# EAGLE design sequencer (EAGLE 9.6.2)
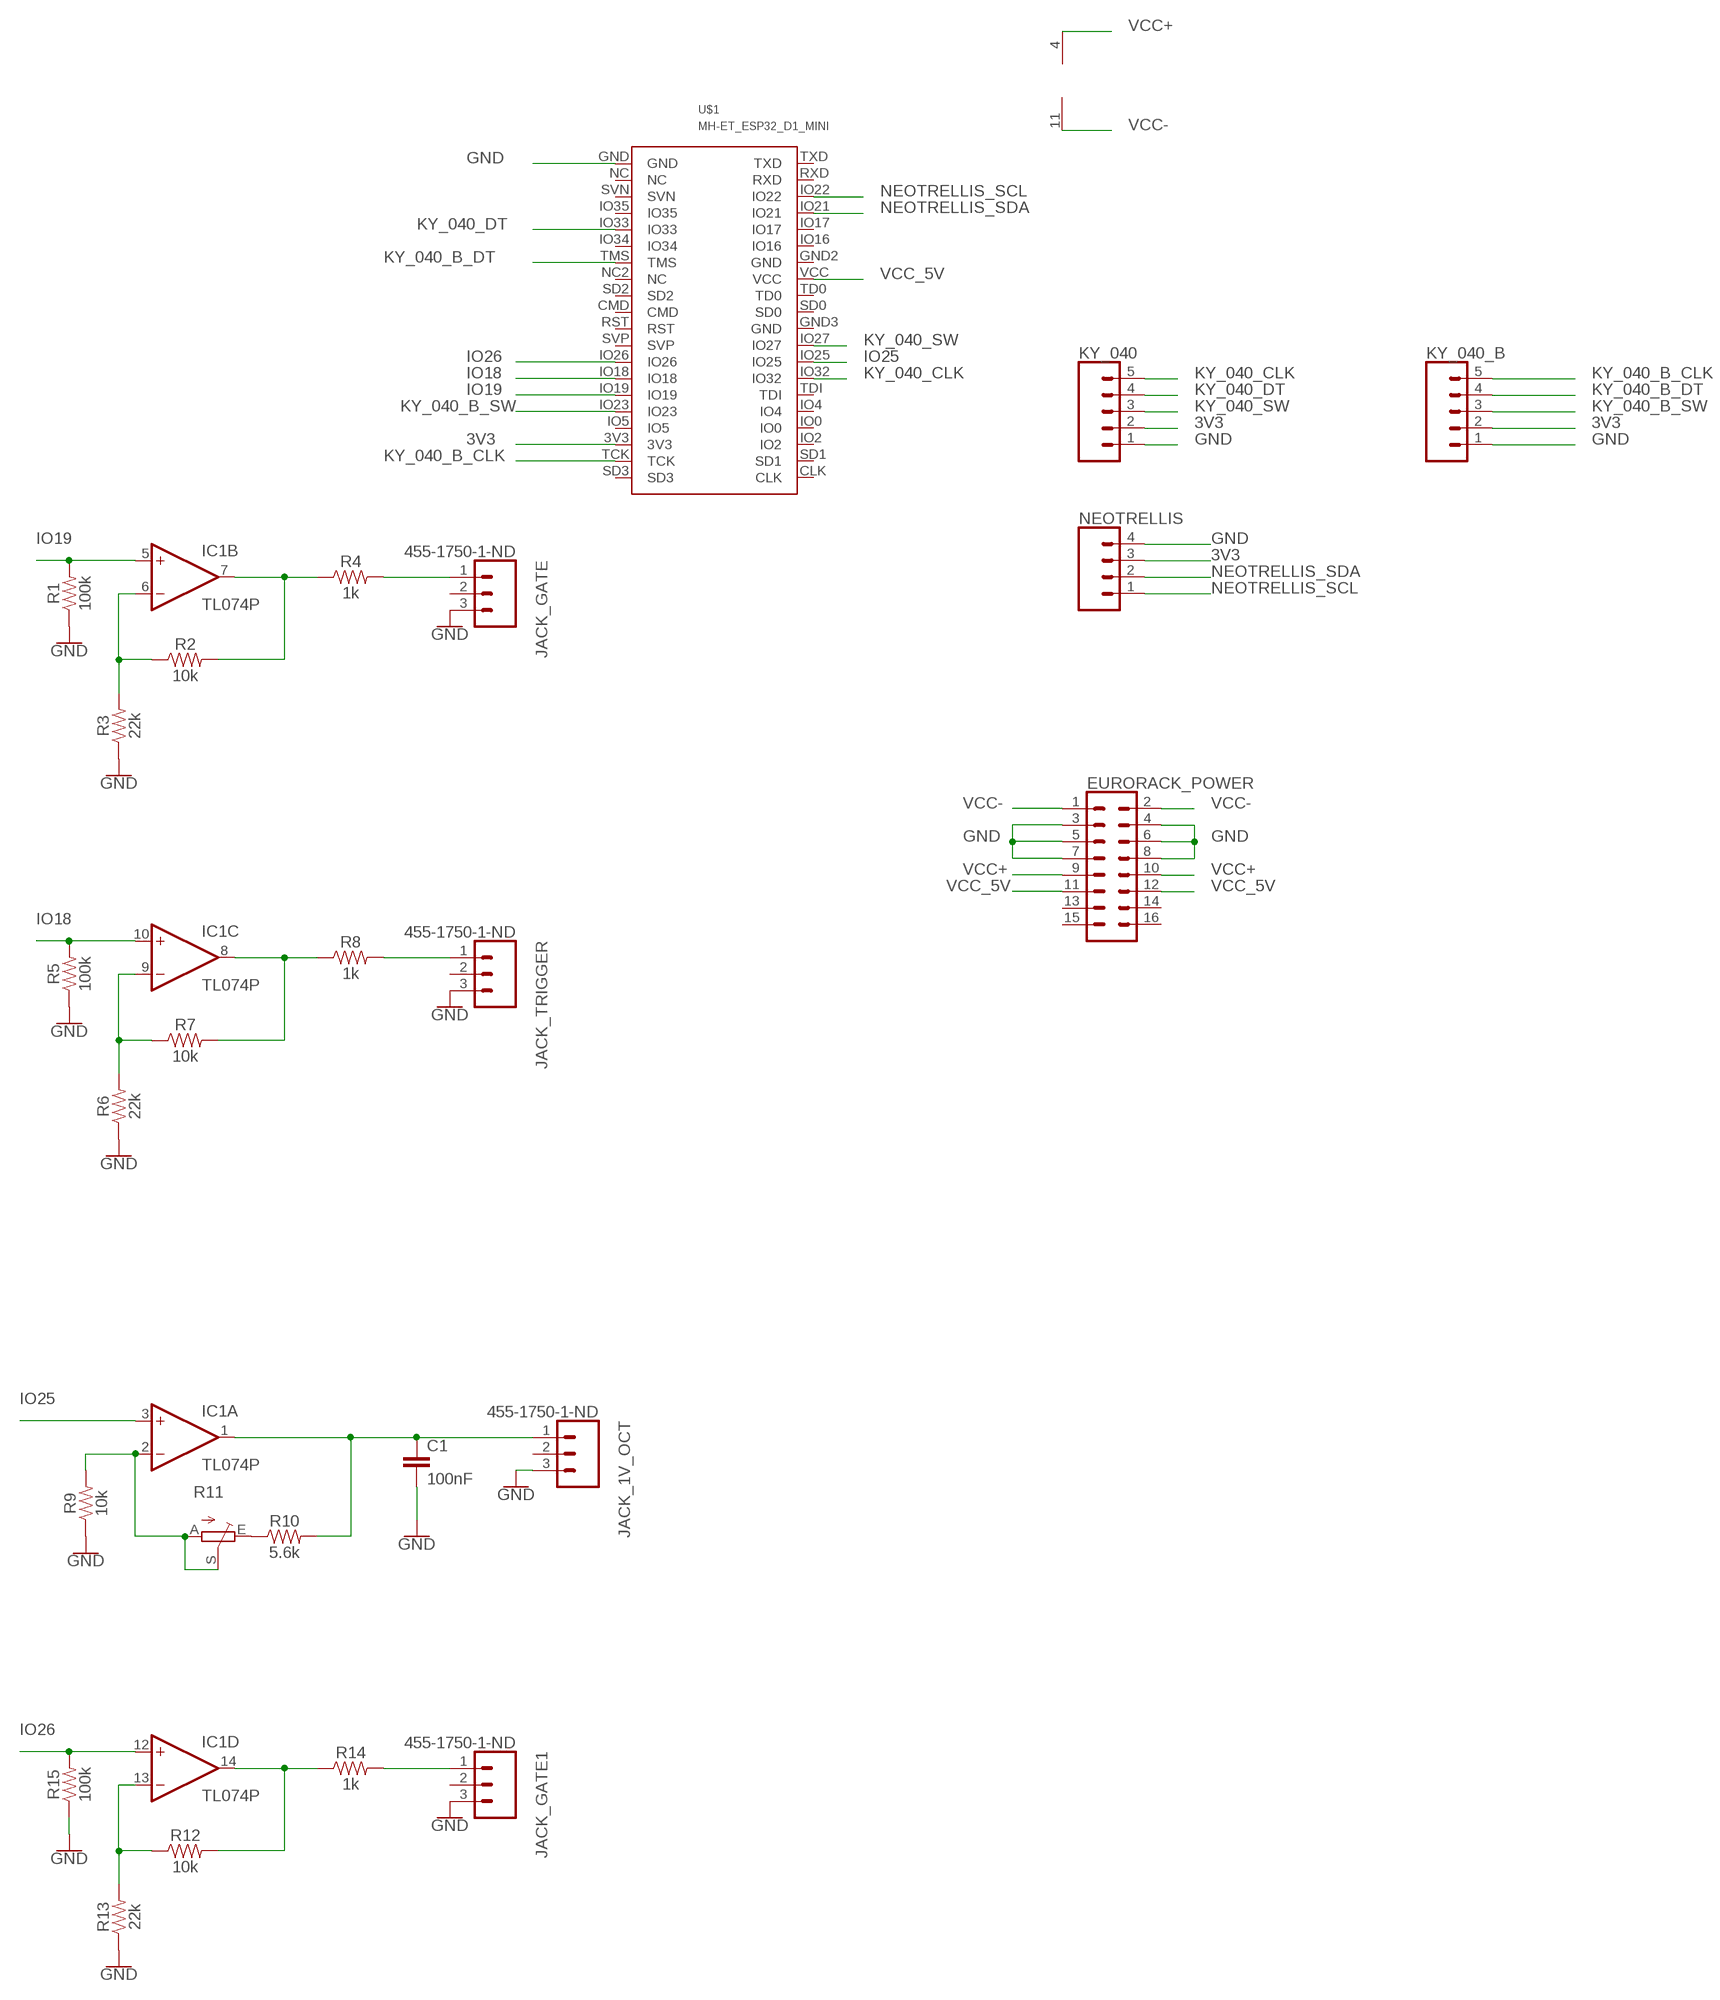
[diagram p0: schematic, sheet 1]

## Parts
C1  100nF  C-EU050-035X075  [C050-035X075]
EURORACK_POWER  CONN_08X2_SHROUD  [2X8-SHROUDED_LOCK]
IC1  TL074P  [DIL14]
JACK_1V_OCT  455-1750-1-ND  CONN_03  [1X03]
JACK_GATE  455-1750-1-ND  CONN_03  [1X03]
JACK_GATE1  455-1750-1-ND  CONN_03  [1X03]
JACK_TRIGGER  455-1750-1-ND  CONN_03  [1X03]
KY_040  CONN_05  [1X05]
KY_040_B  CONN_05  [1X05]
NEOTRELLIS  CONN_04PTH  [1X04]
R1  100k  100KOHM-VERT-1/4W-1%  [AXIAL-0.1]
R2  10k  10KOHM-VERT-1/4W-1%  [AXIAL-0.1]
R3  22k  10KOHM-VERT-1/4W-1%  [AXIAL-0.1]
R4  1k  1KOHM-VERT-1/4W-1%  [AXIAL-0.1]
R5  100k  100KOHM-VERT-1/4W-1%  [AXIAL-0.1]
R6  22k  10KOHM-VERT-1/4W-1%  [AXIAL-0.1]
R7  10k  10KOHM-VERT-1/4W-1%  [AXIAL-0.1]
R8  1k  1KOHM-VERT-1/4W-1%  [AXIAL-0.1]
R9  10k  10KOHM-VERT-1/4W-1%  [AXIAL-0.1]
R10  5.6k  10KOHM-VERT-1/4W-1%  [AXIAL-0.1]
R11  TRIM_EU-B64W  [B64W]
R12  10k  10KOHM-VERT-1/4W-1%  [AXIAL-0.1]
R13  22k  10KOHM-VERT-1/4W-1%  [AXIAL-0.1]
R14  1k  1KOHM-VERT-1/4W-1%  [AXIAL-0.1]
R15  100k  100KOHM-VERT-1/4W-1%  [AXIAL-0.1]
U$1  MH-ET_ESP32_D1_MINI  [MH-ET_ESP32_D1_MINI]

## Nets
3V3: KY_040.2 KY_040_B.2 NEOTRELLIS.3 U$1.3V3
GND: C1.2 EURORACK_POWER.3 EURORACK_POWER.4 EURORACK_POWER.5 EURORACK_POWER.6 EURORACK_POWER.7 EURORACK_POWER.8 JACK_1V_OCT.3 JACK_GATE1.3 JACK_GATE.3 JACK_TRIGGER.3 KY_040.1 KY_040_B.1 NEOTRELLIS.4 R1.P$1 R3.P$1 R5.P$1 R6.P$1 R9.P$1 R13.P$1 R15.P$1 U$1.GND
IO18: IC1.10(C:+IN) R5.P$2 U$1.IO18
IO19: IC1.5(B:+IN) R1.P$2 U$1.IO19
IO25: IC1.3(A:+IN) U$1.IO25
IO26: IC1.12(D:+IN) R15.P$2 U$1.IO26
KY_040_B_CLK: KY_040_B.5 U$1.TCK
KY_040_B_DT: KY_040_B.4 U$1.TMS
KY_040_B_SW: KY_040_B.3 U$1.IO23
KY_040_CLK: KY_040.5 U$1.IO32
KY_040_DT: KY_040.4 U$1.IO33
KY_040_SW: KY_040.3 U$1.IO27
N$1: IC1.6(B:-IN) R2.P$1 R3.P$2
N$2: IC1.7(B:OUT) R2.P$2 R4.P$1
N$3: JACK_GATE.1 R4.P$2
N$4: IC1.9(C:-IN) R6.P$2 R7.P$1
N$5: R7.P$2
N$6: IC1.8(C:OUT) R8.P$1
N$7: JACK_TRIGGER.1 R8.P$2
N$8: IC1.13(D:-IN) R12.P$1 R13.P$2
N$9: C1.1 IC1.1(A:OUT) JACK_1V_OCT.1 R10.P$2
N$10: R10.P$1 R11.E
N$11: IC1.2(A:-IN) R9.P$2 R11.A R11.S
N$12: IC1.14(D:OUT) R12.P$2 R14.P$1
N$13: JACK_GATE1.1 R14.P$2
NEOTRELLIS_SCL: NEOTRELLIS.1 U$1.IO22
NEOTRELLIS_SDA: NEOTRELLIS.2 U$1.IO21
VCC+: EURORACK_POWER.9 EURORACK_POWER.10 IC1.4(P:V+)
VCC-: EURORACK_POWER.1 EURORACK_POWER.2 IC1.11(P:V-)
VCC_5V: EURORACK_POWER.11 EURORACK_POWER.12 U$1.VCC
Unconnected: EURORACK_POWER.13 EURORACK_POWER.14 EURORACK_POWER.15 EURORACK_POWER.16 JACK_1V_OCT.2 JACK_GATE1.2 JACK_GATE.2 JACK_TRIGGER.2 U$1.CLK U$1.CMD U$1.GND2(GND) U$1.GND3(GND) U$1.IO0 U$1.IO2 U$1.IO4 U$1.IO5 U$1.IO16 U$1.IO17 U$1.IO34 U$1.IO35 U$1.NC U$1.NC2(NC) U$1.RST U$1.RXD U$1.SD0 U$1.SD1 U$1.SD2 U$1.SD3 U$1.SVN U$1.SVP U$1.TD0 U$1.TDI U$1.TXD

## Library data of the parts
C1 = rcl:C-EU: CAPACITOR, European symbol; SPICEPREFIX: C
EURORACK_POWER = SparkFun-Connectors:CONN_08X2: Multi connection point. Often used as Generic Header-pin footprint for 0.1 inch spaced/style header connections You can populate with any combo of single row headers, but if you'd like an exact match, check this: Header - 2x8 (Male, 0.1") <https://www.sparkfun.com/products/13156> (PRT-13156) On any of the 0.1 inch spaced packages, you can populate with these: Break Away Headers - Straight <https://www.sparkfun.com/products/116> (PRT-00116) Break Away Male Headers - Right Angle <https://www.sparkfun.com/products/553> (PRT-00553) Female Headers <https://www.sparkfun.com/products/115> (PRT-00115) Break Away Headers - Machine Pin <https://www.sparkfun.com/products/117> (PRT-00117) Break Away Female Headers - Swiss Machine Pin <https://www.sparkfun.com/products/743> (PRT-00743)
IC1 = linear:TL074: OP AMP
JACK_1V_OCT JACK_GATE JACK_GATE1 JACK_TRIGGER = SparkFun-Connectors:CONN_03: Multi connection point. Often used as Generic Header-pin footprint for 0.1 inch spaced/style header connections On any of the 0.1 inch spaced packages, you can populate with these: Break Away Headers - Straight <https://www.sparkfun.com/products/116> (PRT-00116) Break Away Male Headers - Right Angle <https://www.sparkfun.com/products/553> (PRT-00553) Female Headers <https://www.sparkfun.com/products/115> (PRT-00115) Break Away Headers - Machine Pin <https://www.sparkfun.com/products/117> (PRT-00117) Break Away Female Headers - Swiss Machine Pin <https://www.sparkfun.com/products/743> (PRT-00743) Stackable Header - 3 Pin (Female, 0.1") <https://www.sparkfun.com/products/13875> (PRT-13875) For SCREWTERMINALS and SPRING TERMINALS visit here: Screw Terimnals on SparkFun.com <https://www.sparkfun.com/search/results?term=Screw+Terminals> (5mm/3.5mm/2.54mm spacing) This device is also useful as a general connection point to wire up your design to another part of your project. Our various solder wires solder well into these plated through hole pads. Hook-Up Wire - Assortment (Stranded, 22 AWG) <https://www.sparkfun.com/products/11375> (PRT-11375) Hook-Up Wire - Assortment (Solid Core, 22 AWG) <https://www.sparkfun.com/products/11367> (PRT-11367) View the entire wire category on our website here <https://www.sparkfun.com/categories/141> Special notes: Molex polarized connector foot print use with SKU : PRT-08232 with associated crimp pins and housings.; PROD_ID: XXX-00000
KY_040 KY_040_B = SparkFun-Connectors:CONN_05: Multi connection point. Often used as Generic Header-pin footprint for 0.1 inch spaced/style header connections On any of the 0.1 inch spaced packages, you can populate with these: Break Away Headers - Straight <https://www.sparkfun.com/products/116> (PRT-00116) Break Away Male Headers - Right Angle <https://www.sparkfun.com/products/553> (PRT-00553) Female Headers <https://www.sparkfun.com/products/115> (PRT-00115) Break Away Headers - Machine Pin <https://www.sparkfun.com/products/117> (PRT-00117) Break Away Female Headers - Swiss Machine Pin <https://www.sparkfun.com/products/743> (PRT-00743) For SCREWTERMINALS and SPRING TERMINALS visit here: Screw Terimnals on SparkFun.com <https://www.sparkfun.com/search/results?term=Screw+Terminals> (5mm/3.5mm/2.54mm spacing) This device is also useful as a general connection point to wire up your design to another part of your project. Our various solder wires solder well into these plated through hole pads. Hook-Up Wire - Assortment (Stranded, 22 AWG) <https://www.sparkfun.com/products/11375> (PRT-11375) Hook-Up Wire - Assortment (Solid Core, 22 AWG) <https://www.sparkfun.com/products/11367> (PRT-11367) View the entire wire category on our website here <https://www.sparkfun.com/categories/141> Special notes: Molex polarized connector foot print use with SKU : PRT-08231 with associated crimp pins and housings. 1MM SMD Version SKU: PRT-10208
NEOTRELLIS = SparkFun-Connectors:CONN_04: Multi connection point. Often used as Generic Header-pin footprint for 0.1 inch spaced/style header connections On any of the 0.1 inch spaced packages, you can populate with these: Break Away Headers - Straight <https://www.sparkfun.com/products/116> (PRT-00116) Break Away Male Headers - Right Angle <https://www.sparkfun.com/products/553> (PRT-00553) Female Headers <https://www.sparkfun.com/products/115> (PRT-00115) Break Away Headers - Machine Pin <https://www.sparkfun.com/products/117> (PRT-00117) Break Away Female Headers - Swiss Machine Pin <https://www.sparkfun.com/products/743> (PRT-00743) For SCREWTERMINALS and SPRING TERMINALS visit here: Screw Terimnals on SparkFun.com <https://www.sparkfun.com/search/results?term=Screw+Terminals> (5mm/3.5mm/2.54mm spacing) This device is also useful as a general connection point to wire up your design to another part of your project. Our various solder wires solder well into these plated through hole pads. Hook-Up Wire - Assortment (Stranded, 22 AWG) <https://www.sparkfun.com/products/11375> (PRT-11375) Hook-Up Wire - Assortment (Solid Core, 22 AWG) <https://www.sparkfun.com/products/11367> (PRT-11367) View the entire wire category on our website here <https://www.sparkfun.com/categories/141> Special notes: Molex polarized connector foot print use with SKU : PRT-08231 with associated crimp pins and housings. 1MM SMD Version SKU: PRT-10208; PROD_ID: CONN-09696
R1 R5 R15 = SparkFun-Resistors:100KOHM: 100kΩ resistor A resistor is a passive two-terminal electrical component that implements electrical resistance as a circuit element. Resistors act to reduce current flow, and, at the same time, act to lower voltage levels within circuits. - Wikipedia; PROD_ID: RES-12184
R2 R7 R9 R12 = SparkFun-Resistors:10KOHM: 10kΩ resistor A resistor is a passive two-terminal electrical component that implements electrical resistance as a circuit element. Resistors act to reduce current flow, and, at the same time, act to lower voltage levels within circuits. - Wikipedia; PROD_ID: RES-12183
R3 R6 R10 R13 = SparkFun-Resistors:10KOHM: 10kΩ resistor A resistor is a passive two-terminal electrical component that implements electrical resistance as a circuit element. Resistors act to reduce current flow, and, at the same time, act to lower voltage levels within circuits. - Wikipedia; PROD_ID: RES-12183; VALUE: 10k
R4 R8 R14 = SparkFun-Resistors:1KOHM: 1kΩ resistor A resistor is a passive two-terminal electrical component that implements electrical resistance as a circuit element. Resistors act to reduce current flow, and, at the same time, act to lower voltage levels within circuits. - Wikipedia; PROD_ID: RES-12182
R11 = pot:TRIM_EU-: POTENTIOMETER
U$1 = MH-ET_ESP32_D1_MINI:MH-ET_ESP32_D1_MINI

## Board
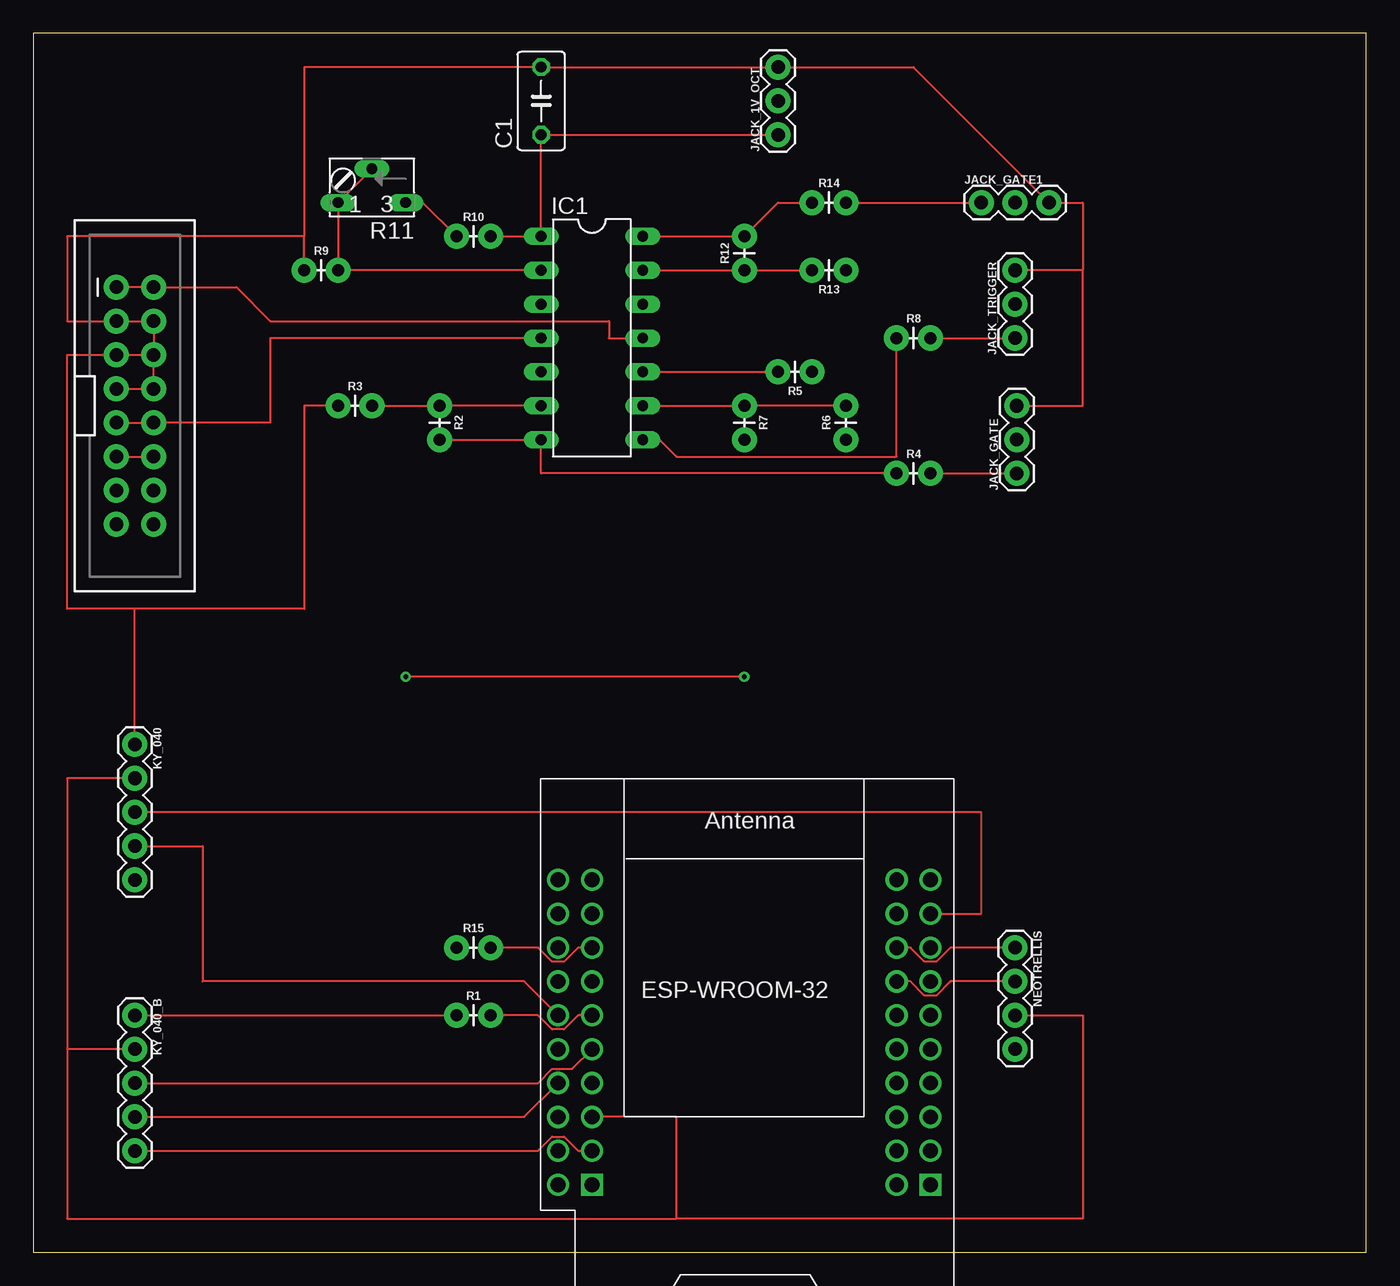
[diagram p1: board, top side]
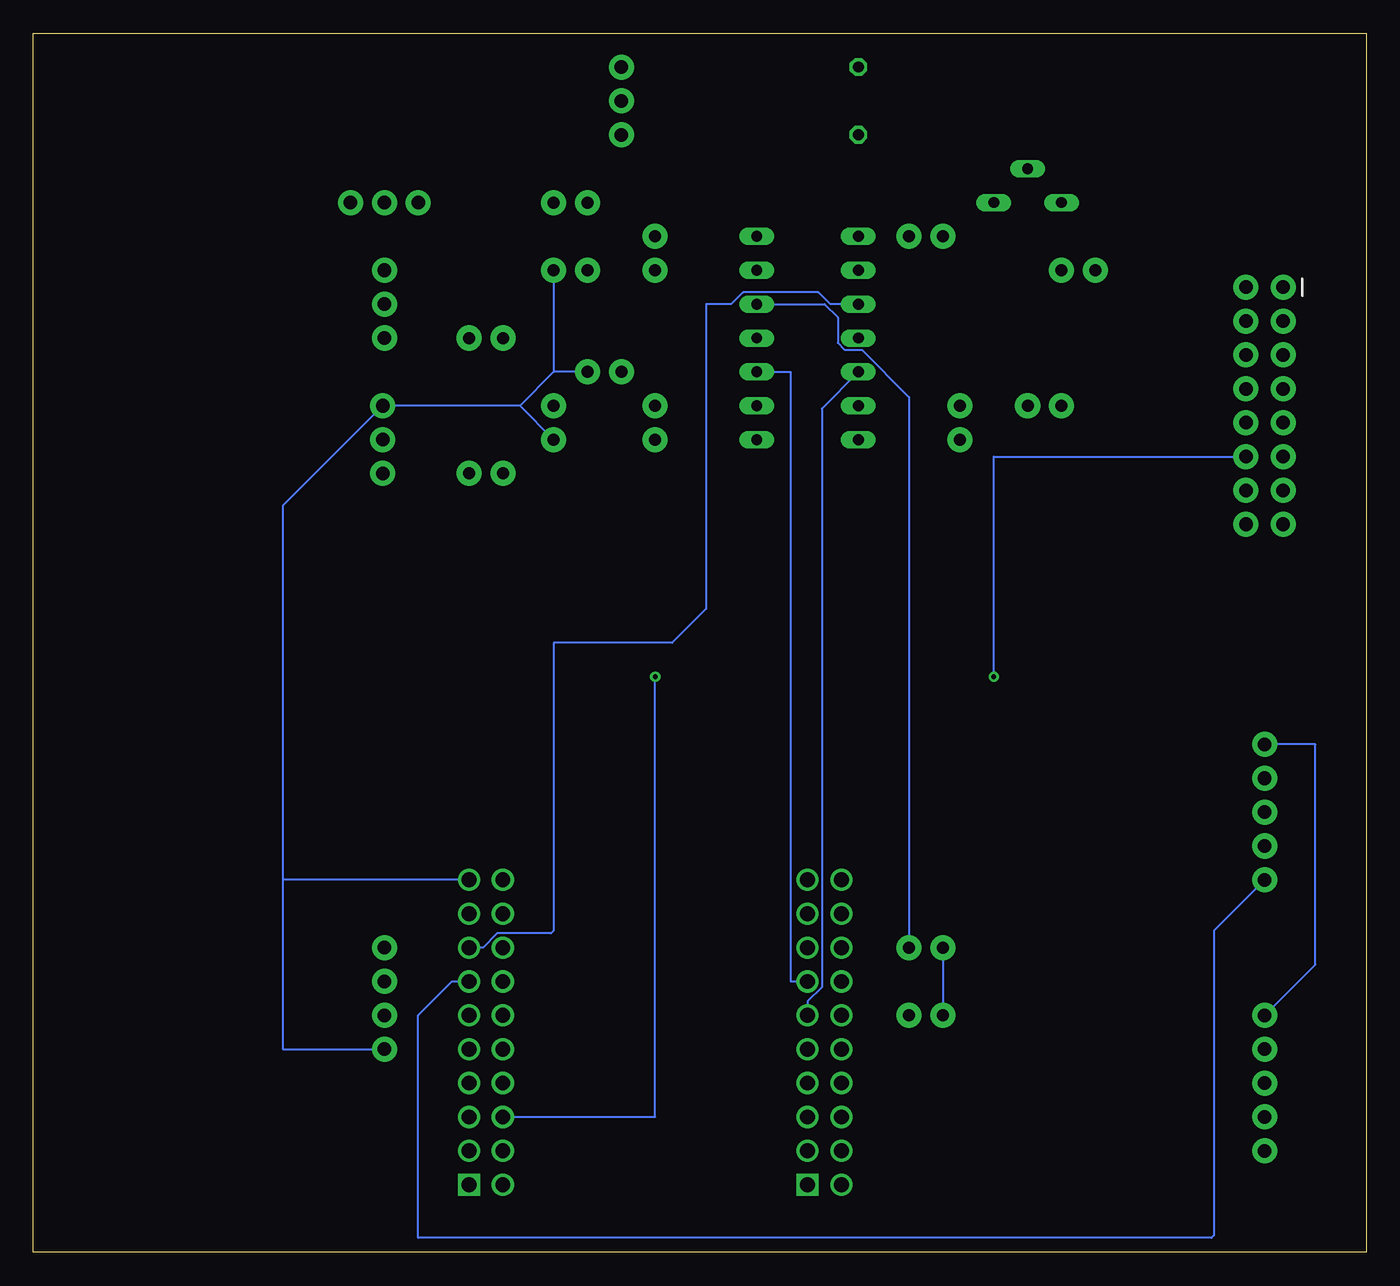
[diagram p2: board, bottom side, seen from below]

Size 100 x 91.43 mm. Coordinates in mm from the lower left corner, seen from the top.
Outline: 0,0 100,0 100,91.43 0,91.43 0,0
Copper layers (1*16): Top 0.035mm / dielectric 1.5mm / Bottom 0.035mm
Design rules "default": minimum track width 6mil, minimum drill 0.35mm, track to track 6mil, track to pad 6mil, pad to pad 6mil, via to via 6mil, smd to smd 6mil, copper to edge 40mil, drill to drill 6mil, minimum pad ring 10mil, minimum via ring 8mil, stop-mask expansion 4mil, vias tented up to drill 0mil, thermal gap 10mil

### Footprints (pad centres in the part's own frame; a part is rotated, then mirrored left to right if it is on the bottom)
C050-035X075 = drill 0.813 octagon: 1 -2.54,0; 2 2.54,0
2X8-SHROUDED_LOCK = drill 1.016 pad 1.88: 1 -1.397,8.89; 2 1.397,8.89; 3 -1.397,6.35; 4 1.397,6.35; 5 -1.397,3.81; 6 1.397,3.81; 7 -1.397,1.27; 8 1.397,1.27; 9 -1.397,-1.27; 10 1.397,-1.27; 11 -1.397,-3.81; 12 1.397,-3.81; 13 -1.397,-6.35; 14 1.397,-6.35; 15 -1.397,-8.89; 16 1.397,-8.89
DIL14 = drill 0.813 long: 1 -7.62,-3.81; 2 -5.08,-3.81; 3 -2.54,-3.81; 4 0,-3.81; 5 2.54,-3.81; 6 5.08,-3.81; 7 7.62,-3.81; 8 7.62,3.81; 9 5.08,3.81; 10 2.54,3.81; 11 0,3.81; 12 -2.54,3.81; 13 -5.08,3.81; 14 -7.62,3.81
1X03 = drill 1.016 pad 1.88: 1 0,0; 2 2.54,0; 3 5.08,0
1X05 = drill 1.016 pad 1.88: 1 0,0; 2 2.54,0; 3 5.08,0; 4 7.62,0; 5 10.16,0
1X04 = drill 1.016 pad 1.88: 1 0,0; 2 2.54,0; 3 5.08,0; 4 7.62,0
AXIAL-0.1 = drill 0.9 pad 1.88: P$1 -1.27,0; P$2 1.27,0
B64W = drill 0.813 long: A 2.54,0; E -2.54,0; S 0,-2.54
MH-ET_ESP32_D1_MINI = drill 1.11 pad 1.665: 3V3 25.4,-5.08; CMD 27.94,0; GND 0,-22.86; GND2 2.54,-7.62; GND3 27.94,-22.86; IO0 0,-7.62; IO2 0,-5.08; IO4 0,-10.16; IO5 25.4,-7.62; IO16 2.54,-10.16; IO17 2.54,-12.7; IO18 25.4,-15.24; IO19 25.4,-12.7; IO21 2.54,-15.24; IO22 2.54,-17.78; IO23 25.4,-10.16; IO25 0,-17.78; IO26 25.4,-17.78; IO27 0,-20.32; IO32 0,-15.24; IO33 27.94,-12.7; IO34 27.94,-10.16; IO35 27.94,-15.24; NC 27.94,-20.32; NC2 27.94,-5.08; RST 25.4,-22.86; RXD 2.54,-20.32; SD0 2.54,0; SD1 0,-2.54; SD2 27.94,-2.54; SVN 27.94,-17.78; SVP 25.4,-20.32; TCK 25.4,-2.54; TD0 2.54,-2.54; TDI 0,-12.7; TMS 27.94,-7.62; TXD 2.54,-22.86; VCC 2.54,-5.08 | drill 1.11 pad 1.665 square: CLK 0,0; SD3 25.4,0

### Placement (x,y rotation side)
C1  38.1,86.36 90 top
EURORACK_POWER  7.62,63.5 0 top
IC1  41.91,68.58 270 top
JACK_1V_OCT  55.88,83.82 90 top
JACK_GATE  73.79,58.42 90 top
JACK_GATE1  71.12,78.74 0 top
JACK_TRIGGER  73.66,68.58 90 top
KY_040  7.62,38.1 270 top
KY_040_B  7.62,17.78 270 top
NEOTRELLIS  73.66,22.86 270 top
R1  33.02,17.78 0 top
R2  30.48,62.23 270 top
R3  24.13,63.5 0 top
R4  66.04,58.42 0 top
R5  57.15,66.04 180 top
R6  60.96,62.23 90 top
R7  53.34,62.23 270 top
R8  66.04,68.58 0 top
R9  21.59,73.66 0 top
R10  33.02,76.2 0 top
R11  25.4,78.74 180 top
R12  53.34,74.93 90 top
R13  59.69,73.66 180 top
R14  59.69,78.74 0 top
R15  33.02,22.86 0 top
U$1  67.31,5.08 180 top

### Tracks (layer width: path | path; a pad name or v marks a point on that pad's centre or on a via)
3V3
  Top 0.152: NEOTRELLIS.3 78.74,17.78 78.74,2.54 48.26,2.54 | 48.26,2.54 48.26,10.16 U$1.3V3 | KY_040_B.2 2.54,15.24 | 2.54,15.24 2.54,2.54 48.26,2.54 | KY_040.2 2.54,35.56 2.54,15.24
GND
  Top 0.152: JACK_GATE.3 78.74,63.5 78.74,73.66 | 78.74,73.66 JACK_TRIGGER.3 | KY_040_B.1 R1.P$1 | EURORACK_POWER.7 EURORACK_POWER.8 EURORACK_POWER.6 | EURORACK_POWER.6 EURORACK_POWER.5 2.54,67.31 2.54,48.26 7.62,48.26 | EURORACK_POWER.6 EURORACK_POWER.4 EURORACK_POWER.3 2.54,69.85 2.54,76.2 20.32,76.2 | R9.P$1 20.32,76.2 | R3.P$1 20.32,63.5 20.32,48.26 7.62,48.26 | KY_040.1 7.62,48.26 | 78.74,73.66 78.74,78.74 JACK_GATE1.3 66.04,88.9 JACK_1V_OCT.3 C1.2 20.32,88.9 20.32,76.2
  Bottom 0.152: 81.28,27.94 81.28,15.24 NEOTRELLIS.4 | U$1.GND 81.28,27.94 | R6.P$1 63.5,63.5 | 63.5,63.5 JACK_GATE.3 81.28,56.01 81.28,27.94 | R15.P$1 R1.P$1 | R5.P$1 60.96,66.04 | 60.96,66.04 63.5,63.5 | R13.P$1 60.96,66.04 | KY_040_B.1 3.81,21.59 3.81,38.1 KY_040.1
IO18
  Top 0.152: IC1.10 R5.P$2
  Bottom 0.152: IC1.10 43.18,66.04 43.18,20.32 U$1.IO18
IO19
  Top 0.152: U$1.IO19 40.87,17.78 39.81,16.72 38.93,16.72 37.87,17.78 R1.P$2
  Bottom 0.152: U$1.IO19 41.91,18.82 40.85,19.88 40.85,63.29 IC1.5
IO25
  Bottom 0.152: IC1.3 40.21,71.12 41.1,72.01 46.75,72.01 47.64,71.12 49.53,71.12 49.53,48.26 52.07,45.72 60.96,45.72 60.96,24.13 61.17,23.92 65.21,23.92 66.27,22.86 U$1.IO25
IO26
  Top 0.152: U$1.IO26 40.87,22.86 39.81,21.8 38.93,21.8 37.87,22.86 R15.P$2
  Bottom 0.152: IC1.12 40.64,71.12 39.65,70.13 39.65,68.21 39.13,67.69 37.83,67.69 34.29,64.15 R15.P$2
KY_040_B_CLK
  Top 0.152: KY_040_B.5 37.87,7.62 38.93,8.68 39.81,8.68 40.87,7.62 U$1.TCK
KY_040_B_DT
  Top 0.152: KY_040_B.4 36.83,10.16 U$1.TMS
KY_040_B_SW
  Top 0.152: KY_040_B.3 37.87,12.7 38.93,13.76 40.43,13.76 U$1.IO23
KY_040_CLK
  Bottom 0.152: KY_040.5 11.43,24.13 11.43,1.27 11.61,1.09 71.12,1.09 71.12,17.78 68.58,20.32 U$1.IO32
KY_040_DT
  Top 0.152: U$1.IO33 36.83,20.32 12.7,20.32 12.7,30.48 KY_040.4
KY_040_SW
  Top 0.152: U$1.IO27 71.12,25.4 71.12,33.02 KY_040.3
N$1
  Top 0.152: IC1.6 R2.P$1 R3.P$2
N$2
  Top 0.152: R4.P$1 38.1,58.42 IC1.7 R2.P$2
N$3
  Top 0.152: R4.P$2 JACK_GATE.1
N$4
  Top 0.152: R6.P$2 R7.P$1 IC1.9
N$6
  Top 0.152: IC1.8 46.99,60.96 48.26,59.69 64.77,59.69 R8.P$1
N$7
  Top 0.152: R8.P$2 JACK_TRIGGER.1
N$8
  Top 0.152: IC1.13 R12.P$1 R13.P$2
N$9
  Top 0.152: R10.P$2 IC1.1 C1.1 JACK_1V_OCT.1
N$10
  Top 0.152: R11.E 29.21,78.74 R10.P$1
N$11
  Top 0.152: R11.S R11.A R9.P$2 IC1.2
N$12
  Top 0.152: IC1.14 R12.P$2 55.88,78.74 R14.P$1
N$13
  Top 0.152: R14.P$2 JACK_GATE1.1
NEOTRELLIS_SCL
  Top 0.152: NEOTRELLIS.1 68.81,22.86 67.75,21.8 66.87,21.8 65.81,22.86 U$1.IO22
NEOTRELLIS_SDA
  Top 0.152: NEOTRELLIS.2 68.81,20.32 67.75,19.26 66.87,19.26 65.81,20.32 U$1.IO21
VCC+
  Top 0.152: IC1.4 17.78,68.58 17.78,62.23 EURORACK_POWER.10 EURORACK_POWER.9
VCC-
  Top 0.152: EURORACK_POWER.1 EURORACK_POWER.2 15.24,72.39 17.78,69.85 43.18,69.85 43.18,68.58 IC1.11
VCC_5V  (via drill 0.35)
  Top 0.152: EURORACK_POWER.11 EURORACK_POWER.12 | v53.34,43.18 v27.94,43.18
  Bottom 0.152: U$1.VCC 53.34,10.16 v53.34,43.18 | v27.94,43.18 27.94,59.69 EURORACK_POWER.12